# EAGLE design controller (EAGLE 6.5.0)
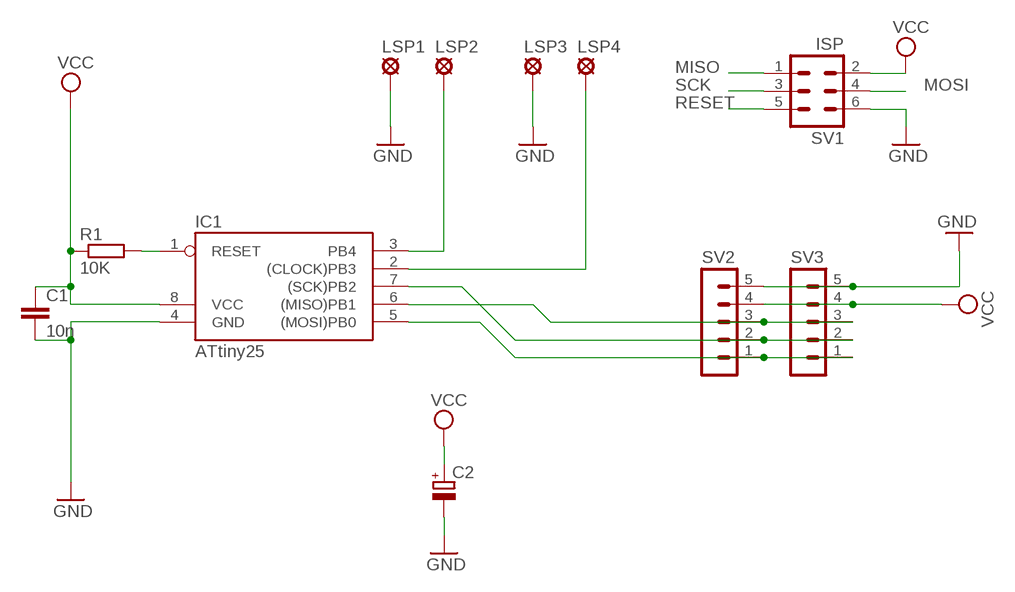
[diagram p0: schematic, sheet 1]

## Parts
C1  10n  C-EU025-024X044  [C025-024X044]
C2  CPOL-EUE2.5-6  [E2,5-6]
IC1  ATtiny25  AT90S2343P  [DIL08]
LSP1  SE11  [SE11]
LSP2  SE11  [SE11]
LSP3  SE11  [SE11]
LSP4  SE11  [SE11]
R1  10K  R-EU_0207/7  [0207/7]
SV1  ISP  MA03-2  [MA03-2]
SV2  MA05-1  [MA05-1]
SV3  MA05-1  [MA05-1]

## Nets
GND: C1.2 C2.- IC1.4(GND) LSP1.MP LSP3.MP SV1.6 SV2.5 SV3.5
MISO: IC1.6((MISO)PB1) SV1.1 SV2.3 SV3.3
MOSI: IC1.5((MOSI)PB0) SV1.4 SV2.1 SV3.1
N$1: IC1.3(PB4) LSP2.MP
N$2: IC1.2((CLOCK)PB3) LSP4.MP
RESET: IC1.1(RESET) R1.2 SV1.5
SCK: IC1.7((SCK)PB2) SV1.3 SV2.2 SV3.2
VCC: C1.1 C2.+ IC1.8(VCC) R1.1 SV1.2 SV2.4 SV3.4

## Library data of the parts
C1 = resistor:C-EU: CAPACITOR, European symbol
C2 = resistor:CPOL-EU: POLARIZED CAPACITOR, European symbol
IC1 = atmel:AT90*2343: MICROCONTROLLER 2 Kbytes FLASH 128 bytes SRAM 128 bytes EEPROM; OC_FARNELL: unknown; OC_NEWARK: unknown
LSP1-LSP4 = solpad:SE11: SOLDER PAD RTM, drill 1,1mm, distributor Buerklin, 07F810
R1 = resistor:R-EU_: RESISTOR, European symbol
SV1 = con-lstb:MA03-2: PIN HEADER; OC_FARNELL: unknown; OC_NEWARK: unknown
SV2 SV3 = con-lstb:MA05-1: PIN HEADER; OC_FARNELL: unknown; OC_NEWARK: unknown

## Board
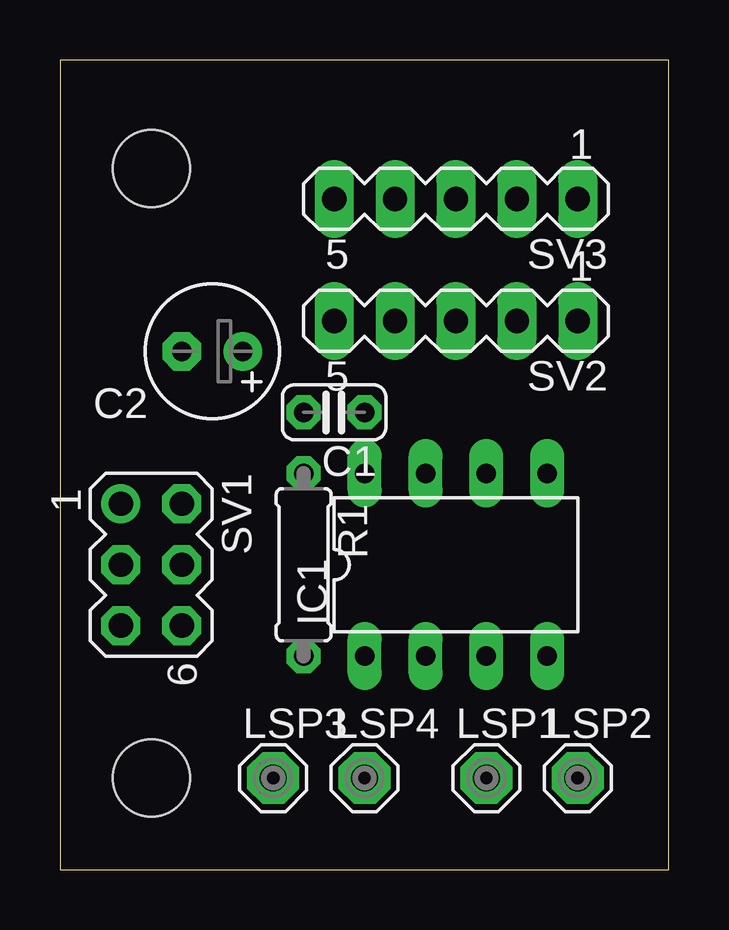
[diagram p1: board, top side]
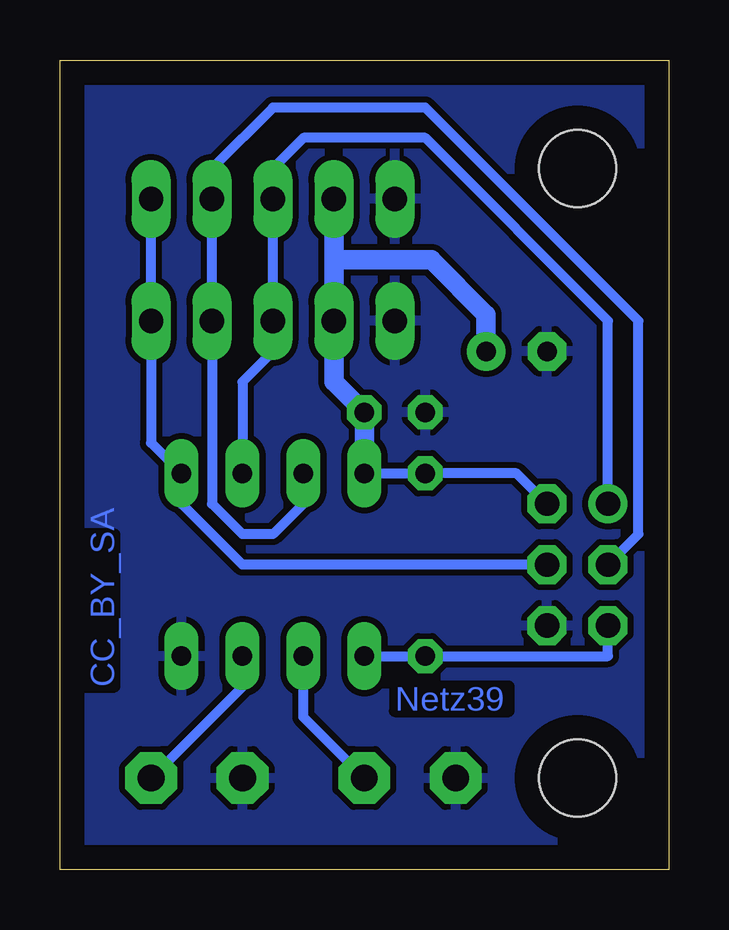
[diagram p2: board, bottom side, seen from below]

Size 25.39 x 33.73 mm. Coordinates in mm from the lower left corner, seen from the top.
Outline: 0,0 25.39,0 25.39,33.73 0,33.73 0,0
Copper layers (1*16): Top 0.035mm / dielectric 1.5mm / Bottom 0.035mm
Design rules "default *": minimum track width 10mil, minimum drill 24mil, track to track 10mil, track to pad 10mil, pad to pad 8mil, via to via 8mil, smd to smd 8mil, copper to edge 40mil, drill to drill 8mil, minimum pad ring 12mil, minimum via ring 8mil, stop-mask expansion 4mil, vias tented up to drill 0mil, thermal gap 10mil
Holes 3.2 mm at 3.81,3.81 3.81,29.21

### Footprints (pad centres in the part's own frame; a part is rotated, then mirrored left to right if it is on the bottom)
C025-024X044 = drill 0.813 octagon: 1 -1.27,0; 2 1.27,0
E2,5-6 = drill 0.813 pad 1.6: + -1.27,0 | drill 0.813 pad 1.6 octagon: - 1.27,0
DIL08 = drill 0.813 long: 1 -3.81,-3.81; 2 -1.27,-3.81; 3 1.27,-3.81; 4 3.81,-3.81; 5 3.81,3.81; 6 1.27,3.81; 7 -1.27,3.81; 8 -3.81,3.81
SE11 = drill 1.118 pad 2.159 octagon: MP 0,0
0207/7 = drill 0.813 octagon: 1 -3.81,0; 2 3.81,0
MA03-2 = drill 1.016: 1 -2.54,-1.27 | drill 1.016 octagon: 2 -2.54,1.27; 3 0,-1.27; 4 0,1.27; 5 2.54,-1.27; 6 2.54,1.27
MA05-1 = drill 1.016 long: 1 -5.08,0; 2 -2.54,0; 3 0,0; 4 2.54,0; 5 5.08,0

### Placement (x,y rotation side)
C1  11.43,19.05 180 top
C2  6.35,21.59 180 top
IC1  16.51,12.7 0 top
LSP1  17.78,3.81 0 top
LSP2  21.59,3.81 0 top
LSP3  8.89,3.81 0 top
LSP4  12.7,3.81 0 top
R1  10.16,12.7 270 top
SV1  3.81,12.7 270 top
SV2  16.51,22.86 180 top
SV3  16.51,27.94 180 top

### Tracks (layer width: path | path; a pad name or v marks a point on that pad's centre or on a via)
GND
  pour Bottom (isolate 0.254): 0,34.29 25.4,34.29 25.4,0 0,0
MISO
  Bottom 0.406: IC1.6 17.78,20.32 16.51,21.59 SV2.3 SV3.3 16.51,29.21 15.24,30.48 10.16,30.48 2.54,22.86 SV1.1
MOSI
  Bottom 0.406: SV3.1 SV2.1 21.59,17.78 IC1.5 20.32,15.24 17.78,12.7 SV1.4
N$1
  Bottom 0.406: LSP2.MP 17.78,7.62 IC1.3
N$2
  Bottom 0.406: LSP4.MP 15.24,6.35 IC1.2
RESET
  Bottom 0.406: IC1.1 R1.2 2.54,8.89 SV1.5
SCK
  Bottom 0.406: IC1.7 15.24,15.24 16.51,13.97 17.78,13.97 19.05,15.24 SV2.2 SV3.2 19.05,29.21 16.51,31.75 10.16,31.75 1.27,22.86 1.27,13.97 SV1.3
VCC
  Bottom 0.406: IC1.8 R1.1 6.35,16.51 SV1.2
  Bottom 0.813: IC1.8 C1.1 13.97,20.32 SV2.4 13.97,25.4 | 13.97,25.4 SV3.4 | 13.97,25.4 9.91,25.4 7.62,23.11 C2.+

### Text on the board
Bottom: Netz39 | CC_BY_SA